# EAGLE design rj45-breakout (EAGLE 6.5.0)
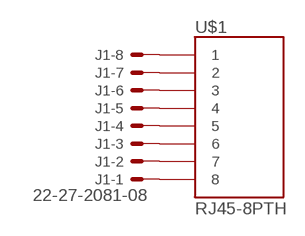
[diagram p0: schematic, sheet 1]

## Parts
J1  22-27-2081-08  [6410-08]
U$1  RJ45-8PTH  [RJ45-8]

## Nets
N$1: J1.8 U$1.1
N$2: J1.7 U$1.2
N$3: J1.6 U$1.3
N$4: J1.5 U$1.4
N$5: J1.4 U$1.5
N$6: J1.3 U$1.6
N$7: J1.2 U$1.7
N$8: J1.1 U$1.8

## Library data of the parts
J1 = con-molex:22-?-08: CONNECTOR wire to board 2.54 mm (.1 inch) pitch header; OC_FARNELL: unknown; OC_NEWARK: unknown
U$1 = SparkFun:RJ45-8: RJ45 Jack Simple RJ45, 8-pin connection - connector for common Cat5, Cat5e, and Cat6 Ethernet cables. Footprint not yet proven in production. Connector sku is PRT-00643; Breakout PCB sku is BOB-00716.

## Board
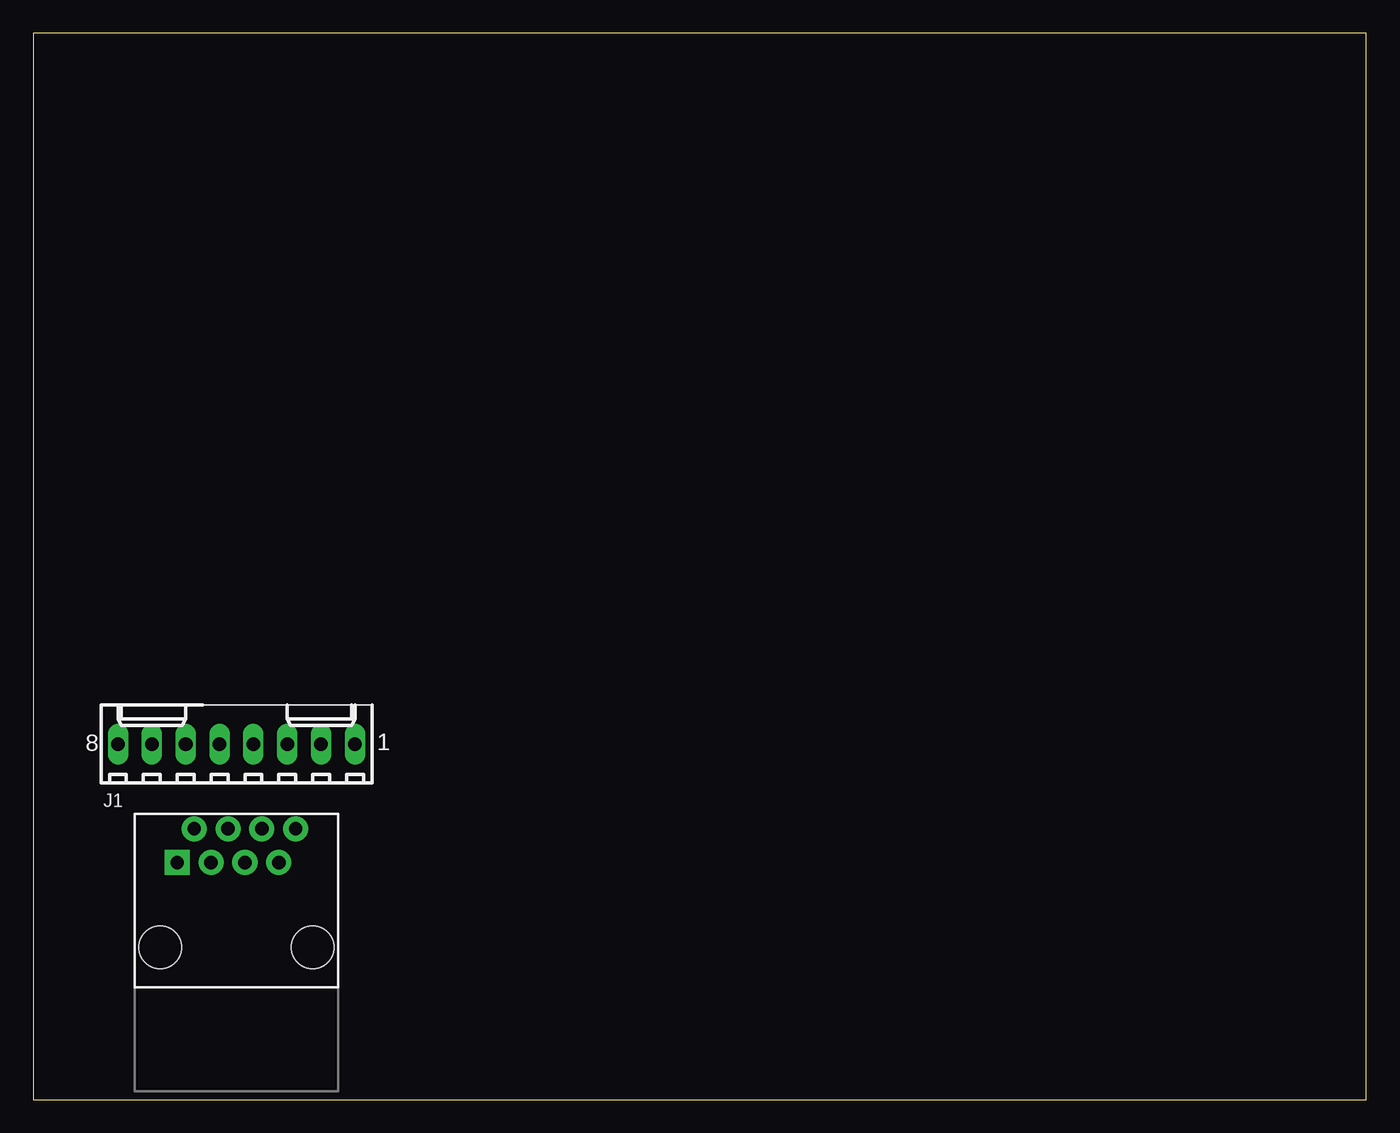
[diagram p1: board, top side]
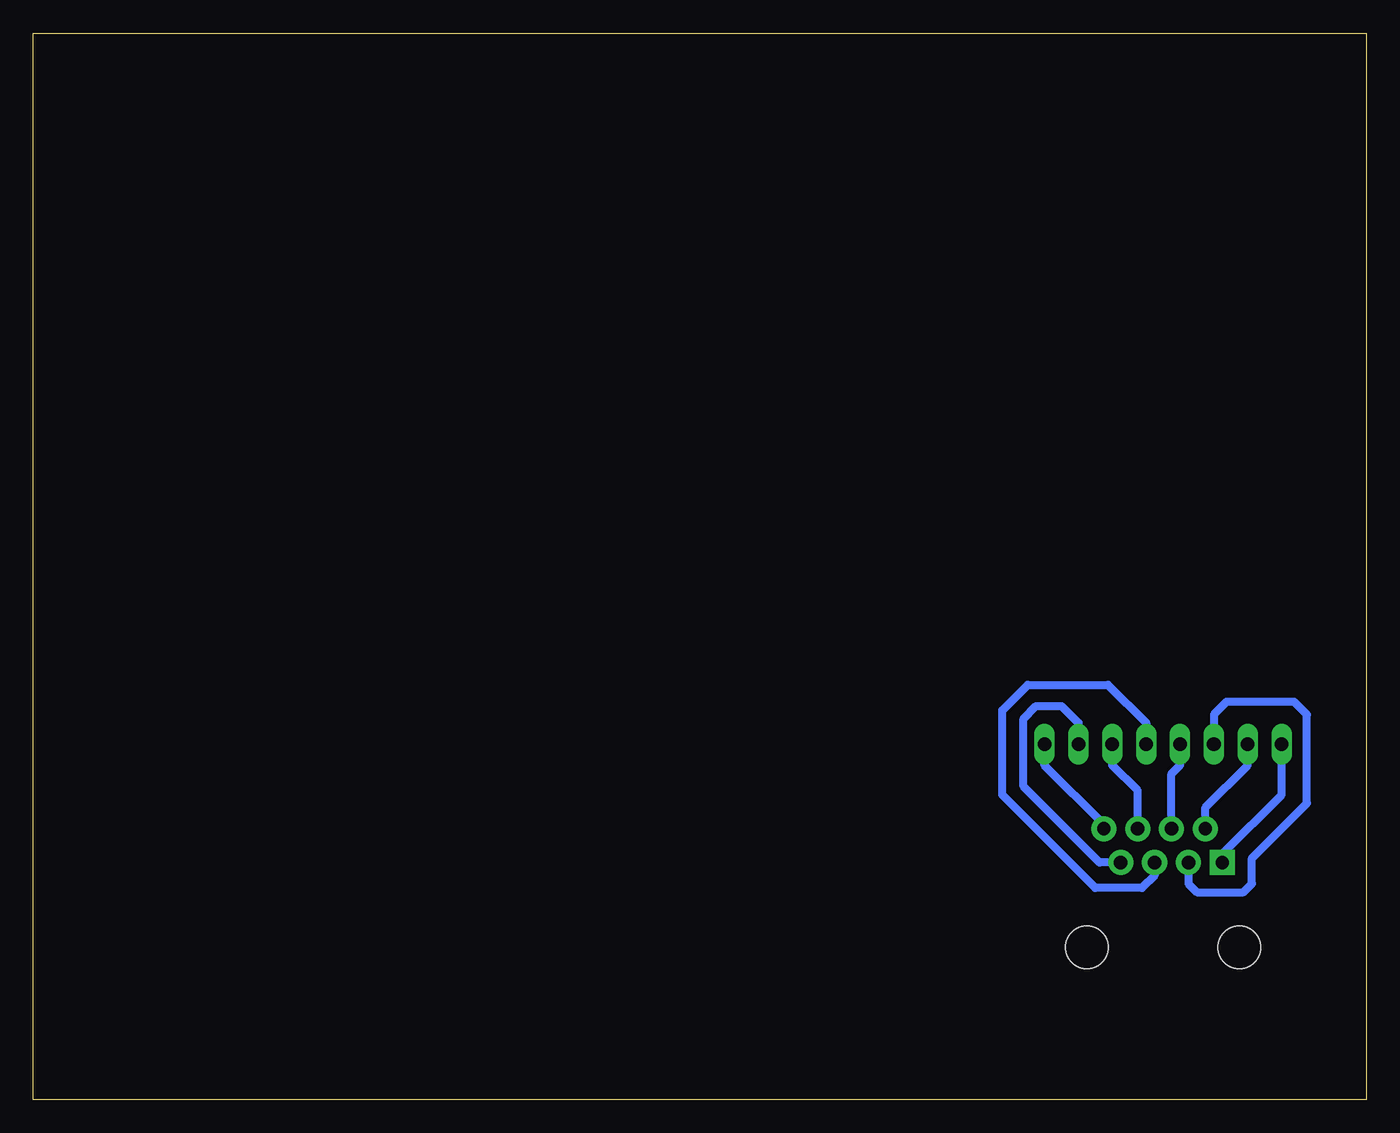
[diagram p2: board, bottom side, seen from below]

Size 100 x 80 mm. Coordinates in mm from the lower left corner, seen from the top.
Outline: 0,0 100,0 100,80 0,80 0,0
Copper layers (1*16): Top 0.035mm / dielectric 1.5mm / Bottom 0.035mm
Design rules "default": minimum track width 10mil, minimum drill 24mil, track to track 8mil, track to pad 8mil, pad to pad 8mil, via to via 8mil, smd to smd 8mil, copper to edge 40mil, drill to drill 8mil, minimum pad ring 10mil, minimum via ring 8mil, stop-mask expansion 4mil, vias tented up to drill 0mil, thermal gap 10mil

### Footprints (pad centres in the part's own frame; a part is rotated, then mirrored left to right if it is on the bottom)
6410-08 = drill 1.016 long: 1 8.89,0; 2 6.35,0; 3 3.81,0; 4 1.27,0; 5 -1.27,0; 6 -3.81,0; 7 -6.35,0; 8 -8.89,0
RJ45-8 = drill 1 pad 1.88 square: 1 -4.445,6.35 | drill 1 pad 1.88: 2 -3.175,8.89; 3 -1.905,6.35; 4 -0.635,8.89; 5 0.635,6.35; 6 1.905,8.89; 7 3.175,6.35; 8 4.445,8.89 | hole 3.2: -5.715,0; 5.715,0

### Placement (x,y rotation side)
J1  15.24,26.67 0 top
U$1  15.24,11.43 0 top

### Tracks (layer width: path | path; a pad name or v marks a point on that pad's centre or on a via)
N$1
  Bottom 0.61: U$1.1 10.79,18.41 6.35,22.86 J1.8
N$2
  Bottom 0.61: U$1.2 12.06,21.91 8.89,25.08 J1.7
N$3
  Bottom 0.61: U$1.3 13.34,16.19 12.7,15.56 9.21,15.56 8.57,16.19 8.57,18.1 4.45,22.23 4.45,28.89 5.4,29.84 10.48,29.84 11.43,28.89 J1.6
N$4
  Bottom 0.61: U$1.4 14.61,24.45 13.97,25.08 J1.5
N$5
  Bottom 0.61: U$1.5 15.88,16.83 16.83,15.88 20.32,15.88 27.3,22.86 27.3,29.21 25.4,31.11 19.37,31.11 16.51,28.26 J1.4
N$6
  Bottom 0.61: U$1.6 17.14,23.18 19.05,25.08 J1.3
N$7
  Bottom 0.61: U$1.7 20,17.78 25.72,23.5 25.72,28.57 24.77,29.53 22.86,29.53 21.59,28.26 J1.2
N$8
  Bottom 0.61: U$1.8 19.68,20.64 24.13,25.08 J1.1